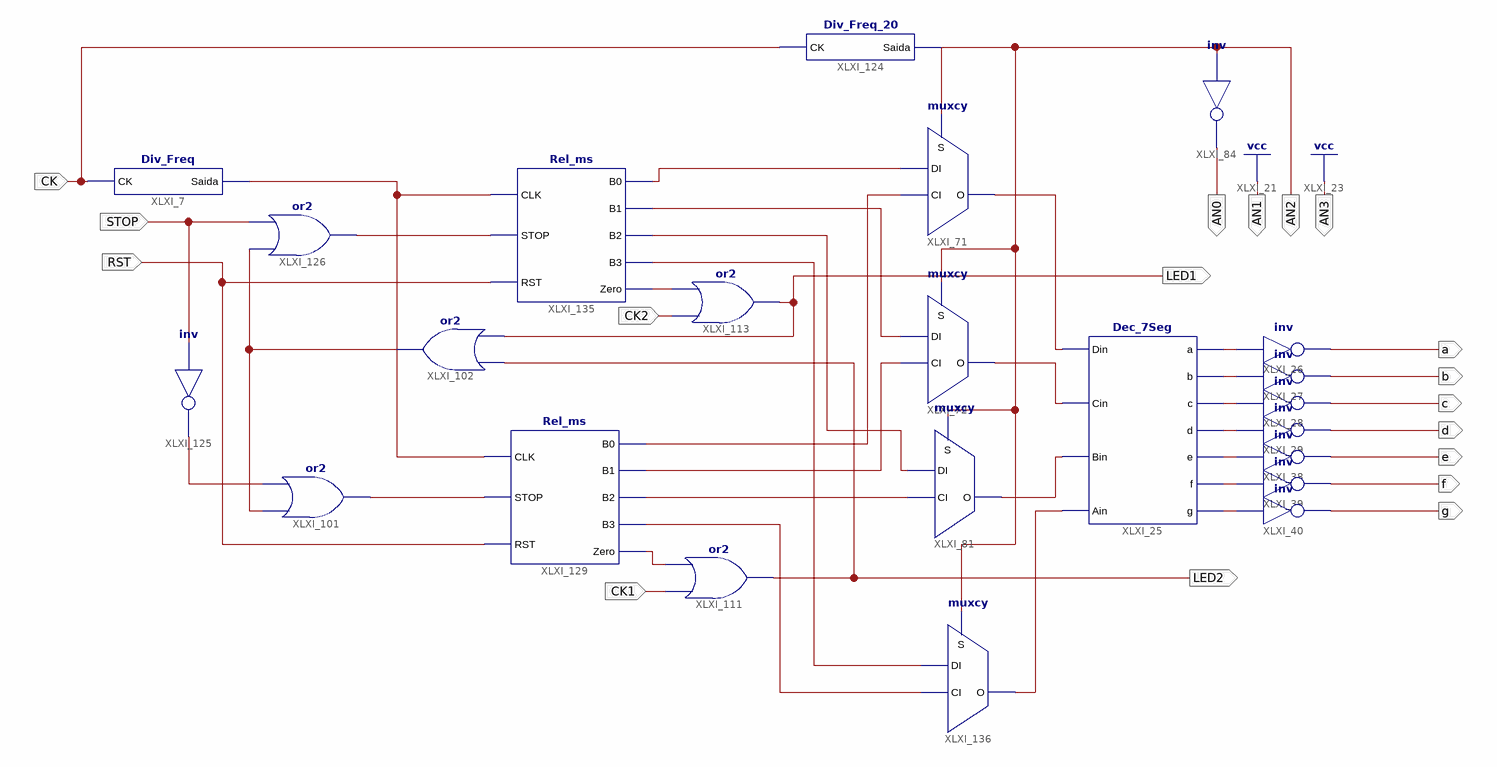
[diagram p0: schematic sheet 1]
// Xilinx ISE schematic TOP.sch (spartan3) as structural Verilog: 23 symbols, 18 ports
module TOP (
  input  RST,
  input  CK,
  input  STOP,
  input  CK1,
  input  CK2,
  output a,
  output b,
  output c,
  output d,
  output e,
  output f,
  output g,
  output LED1,
  output LED2,
  output AN0,
  output AN1,
  output AN3,
  output AN2
);

  wire XLXN_39, XLXN_40, XLXN_41, XLXN_42, XLXN_51, XLXN_52, XLXN_53, XLXN_89, XLXN_90, XLXN_127, XLXN_142,
       XLXN_143, XLXN_144, XLXN_147, XLXN_148, XLXN_201, XLXN_205, XLXN_235, XLXN_255, XLXN_256, XLXN_257,
       XLXN_258, XLXN_274, XLXN_285, XLXN_286, XLXN_289;

  Dec_7Seg XLXI_25 (
    .Din(XLXN_127), .Cin(XLXN_142), .Bin(XLXN_143), .Ain(XLXN_289), .a(XLXN_39), .b(XLXN_40), .c(XLXN_41),
    .d(XLXN_42), .e(XLXN_51), .f(XLXN_52), .g(XLXN_53));
  not XLXI_29 (d, XLXN_42);
  not XLXI_28 (c, XLXN_41);
  not XLXI_27 (b, XLXN_40);
  not XLXI_26 (a, XLXN_39);
  not XLXI_38 (e, XLXN_51);
  not XLXI_39 (f, XLXN_52);
  not XLXI_40 (g, XLXN_53);
  muxcy XLXI_71 (.CI(XLXN_144), .DI(XLXN_148), .S(AN2), .O(XLXN_127));
  muxcy XLXI_72 (.CI(XLXN_89), .DI(XLXN_147), .S(AN2), .O(XLXN_142));
  muxcy XLXI_81 (.CI(XLXN_90), .DI(XLXN_201), .S(AN2), .O(XLXN_143));
  or XLXI_101 (XLXN_256, XLXN_205, XLXN_257);
  or XLXI_102 (XLXN_205, LED1, LED2);
  Div_Freq XLXI_7 (.CK(CK), .Saida(XLXN_255));
  not XLXI_84 (AN0, AN2);
  Div_Freq_20 XLXI_124 (.CK(CK), .Saida(AN2));
  not XLXI_125 (XLXN_257, STOP);
  or XLXI_126 (XLXN_258, XLXN_205, STOP);
  Rel_ms XLXI_129 (
    .B0(XLXN_144), .B1(XLXN_89), .B2(XLXN_90), .B3(XLXN_286), .Zero(XLXN_274), .STOP(XLXN_256), .RST(RST),
    .CLK(XLXN_255));
  or XLXI_111 (LED2, CK1, XLXN_274);
  or XLXI_113 (LED1, CK2, XLXN_235);
  Rel_ms XLXI_135 (
    .B0(XLXN_148), .B1(XLXN_147), .B2(XLXN_201), .B3(XLXN_285), .Zero(XLXN_235), .STOP(XLXN_258), .RST(RST),
    .CLK(XLXN_255));
  muxcy XLXI_136 (.CI(XLXN_286), .DI(XLXN_285), .S(AN2), .O(XLXN_289));

  assign AN1 = 1'b1;
  assign AN3 = 1'b1;
endmodule
